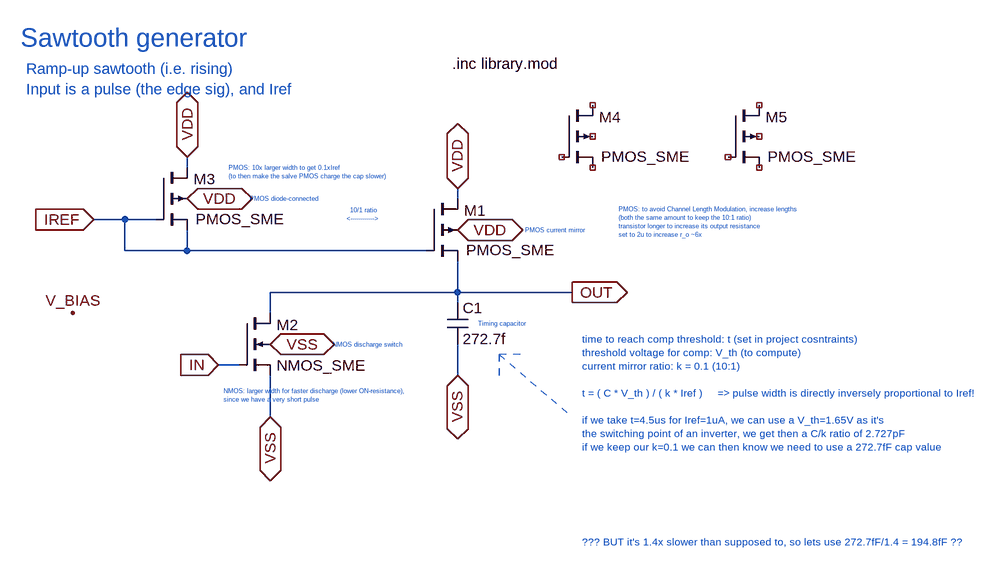
[diagram p0: schematic my_sawtooth_gen.bk.asc]
my_sawtooth_gen.bk.asc, the LTspice schematic file:
Version 4.1
SHEET 1 1580 1548
WIRE 160 112 160 96
WIRE 576 160 576 144
WIRE 64 192 16 192
WIRE 112 192 64 192
WIRE 64 240 64 192
WIRE 160 240 160 208
WIRE 160 240 64 240
WIRE 528 240 160 240
WIRE 576 304 576 256
WIRE 576 304 288 304
WIRE 752 304 576 304
WIRE 576 320 576 304
WIRE 288 336 288 304
WIRE 240 416 208 416
WIRE 576 432 576 384
WIRE 288 496 288 432
FLAG -16 336 V_BIAS
FLAG 208 416 IN
IOPIN 208 416 In
FLAG 16 192 IREF
IOPIN 16 192 In
FLAG 752 304 OUT
IOPIN 752 304 Out
FLAG 576 144 VDD
IOPIN 576 144 BiDir
FLAG 160 96 VDD
IOPIN 160 96 BiDir
FLAG 160 160 VDD
IOPIN 160 160 BiDir
FLAG 576 208 VDD
IOPIN 576 208 BiDir
FLAG 576 432 VSS
IOPIN 576 432 BiDir
FLAG 288 496 VSS
IOPIN 288 496 BiDir
FLAG 288 384 VSS
IOPIN 288 384 BiDir
SYMBOL pmos4 528 160 R0
WINDOW 0 58 18 Left 2
WINDOW 3 61 79 Left 2
SYMATTR InstName M1
SYMATTR Value PMOS_SME
SYMATTR Value2 l=5u w=1u
SYMBOL cap 560 320 R0
SYMATTR InstName C1
SYMATTR Value 272.7f
SYMBOL nmos4 240 336 R0
WINDOW 0 58 18 Left 2
WINDOW 3 58 81 Left 2
SYMATTR InstName M2
SYMATTR Value NMOS_SME
SYMATTR Value2 l=0.35u w=1.8u
SYMBOL pmos4 112 112 R0
WINDOW 0 58 18 Left 2
WINDOW 3 61 79 Left 2
SYMATTR InstName M3
SYMATTR Value PMOS_SME
SYMATTR Value2 l=5u w=10u
SYMBOL pmos4 736 16 R0
WINDOW 0 58 18 Left 2
WINDOW 3 61 79 Left 2
SYMATTR InstName M4
SYMATTR Value PMOS_SME
SYMATTR Value2 l=5u w=10u
SYMBOL pmos4 992 16 R0
WINDOW 0 58 18 Left 2
WINDOW 3 61 79 Left 2
SYMATTR InstName M5
SYMATTR Value PMOS_SME
SYMATTR Value2 l=5u w=1u
TEXT -96 -88 Left 4 ;Sawtooth generator
TEXT -88 -40 Left 2 ;Ramp-up sawtooth (i.e. rising)\nInput is a pulse (the edge sig), and Iref
TEXT 680 208 Left 0 ;PMOS current mirror
TEXT 608 352 Left 0 ;Timing capacitor
TEXT 384 384 Left 0 ;NMOS discharge switch
TEXT 256 160 Left 0 ;PMOS diode-connected
TEXT 568 -48 Left 2 !.inc library.mod
TEXT 216 456 Left 0 ;NMOS: larger width for faster discharge (lower ON-resistance),\nsince we have a very short pulse
TEXT 224 112 Left 0 ;PMOS: 10x larger width to get 0.1xIref\n(to then make the salve PMOS charge the cap slower)
TEXT 824 176 Left 0 ;PMOS: to avoid Channel Length Modulation, increase lengths\n(both the same amount to keep the 10:1 ratio)\ntransistor longer to increase its output resistance\nset to 2u to increase r_o ~6x
TEXT 768 376 Left 1 ;time to reach comp threshold: t (set in project cosntraints)\nthreshold voltage for comp: V_th (to compute)\ncurrent mirror ratio: k = 0.1 (10:1)\n \nt = ( C * V_th ) / ( k * Iref )     => pulse width is directly inversely proportional to Iref!\n \nif we take t=4.5us for Iref=1uA, we can use a V_th=1.65V as it's\nthe switching point of an inverter, we get then a C/k ratio of 2.727pF\nif we keep our k=0.1 we can then know we need to use a 272.7fF cap value\n \n \n\n \n\n \n??? BUT it's 1.4x slower than supposed to, so lets use 272.7fF/1.4 = 194.8fF ??
TEXT 432 184 Center 0 ;10/1 ratio\n<------------>
LINE Normal 640 400 752 496 1
LINE Normal 640 432 640 400 1
LINE Normal 640 400 640 432 2
LINE Normal 672 400 640 400 1

The netlist it stands for:
* my_sawtooth_gen.bk.asc
M1 VDD IREF OUT VDD PMOS_SME l=5u w=1u
C1 OUT VSS 272.7f
M2 OUT IN VSS VSS NMOS_SME l=0.35u w=1.8u
M3 VDD IREF IREF VDD PMOS_SME l=5u w=10u
M4 NC_01 NC_02 NC_03 NC_04 PMOS_SME l=5u w=10u
M5 NC_05 NC_06 NC_07 NC_08 PMOS_SME l=5u w=1u
.model NMOS NMOS
.model PMOS PMOS
.lib standard.mos
* Sawtooth generator
* Ramp-up sawtooth (i.e. rising)
* Input is a pulse (the edge sig), and Iref
* PMOS current mirror
* Timing capacitor
* NMOS discharge switch
* PMOS diode-connected
.inc library.mod
* NMOS: larger width for faster discharge (lower ON-resistance),
* since we have a very short pulse
* PMOS: 10x larger width to get 0.1xIref
* (to then make the salve PMOS charge the cap slower)
* PMOS: to avoid Channel Length Modulation, increase lengths
* (both the same amount to keep the 10:1 ratio)
* transistor longer to increase its output resistance
* set to 2u to increase r_o ~6x
* time to reach comp threshold: t (set in project cosntraints)
* threshold voltage for comp: V_th (to compute)
* current mirror ratio: k = 0.1 (10:1)
* t = ( C * V_th ) / ( k * Iref )     => pulse width is directly inversely proportional to Iref!
* if we take t=4.5us for Iref=1uA, we can use a V_th=1.65V as it's
* the switching point of an inverter, we get then a C/k ratio of 2.727pF
* if we keep our k=0.1 we can then know we need to use a 272.7fF cap value
* ??? BUT it's 1.4x slower than supposed to, so lets use 272.7fF/1.4 = 194.8fF ??
* 10/1 ratio
* <------------>
.backanno
.end